# EAGLE design coil (EAGLE 8.0.2)
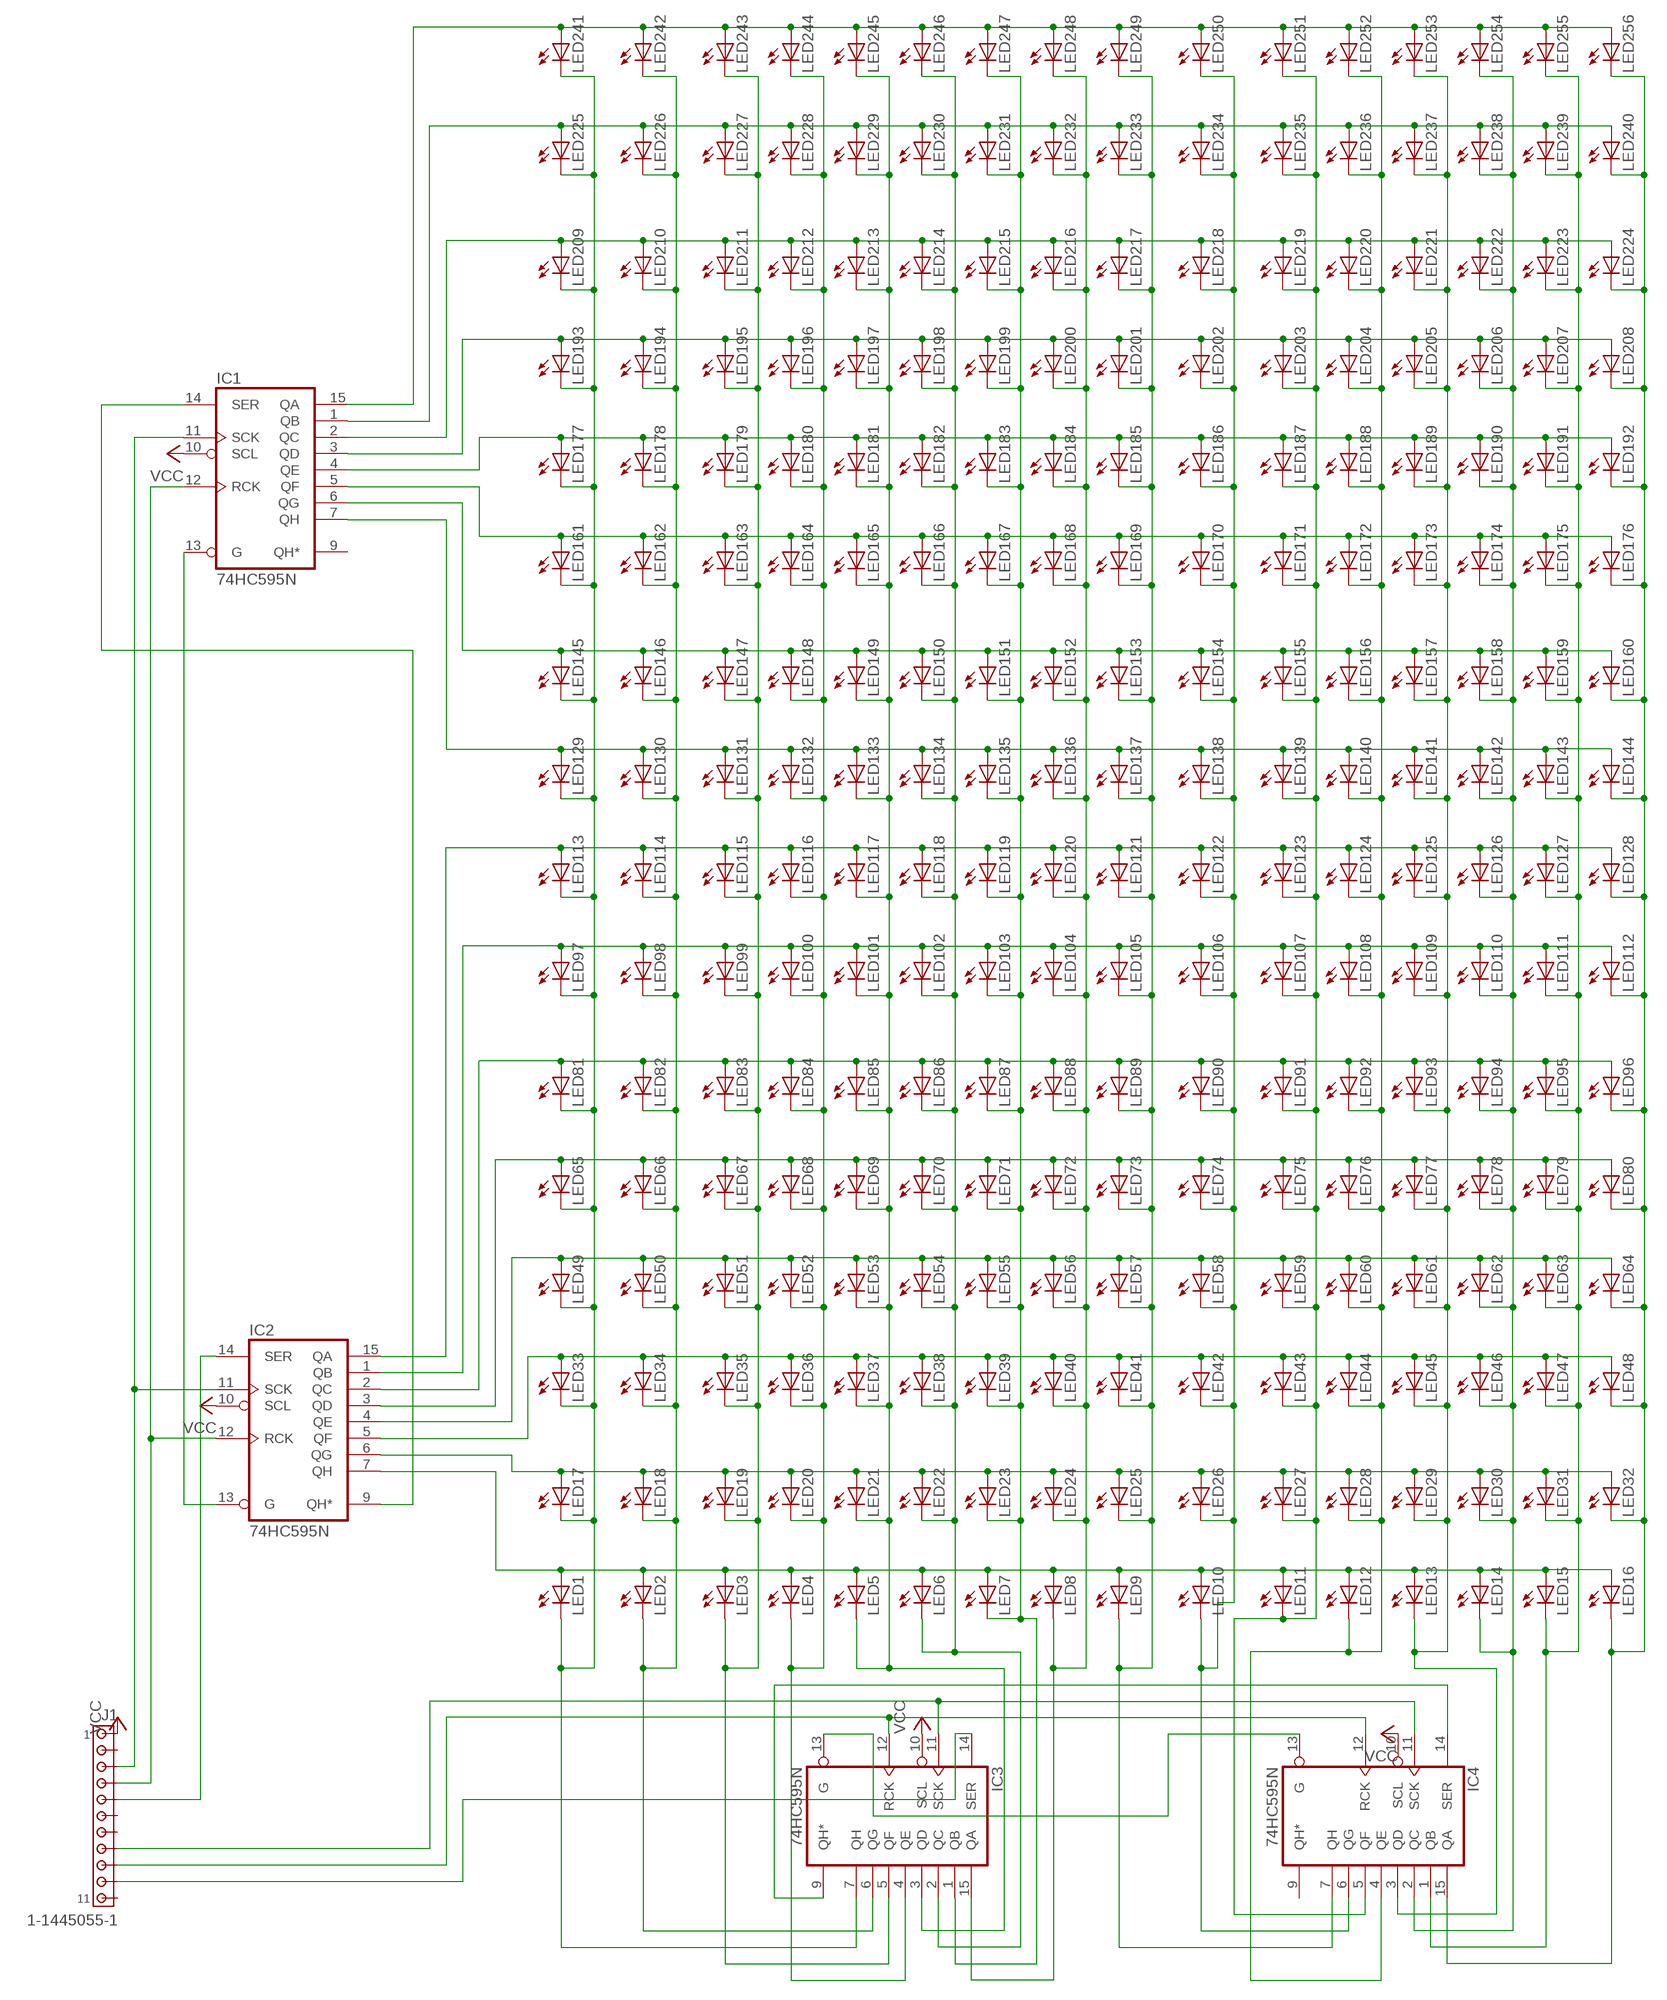
[diagram p0: schematic, sheet 1]

## Parts
IC1  74HC595N  [DIL16]
IC2  74HC595N  [DIL16]
IC3  74HC595N  [DIL16]
IC4  74HC595N  [DIL16]
J1  1-1445055-1  [1-1445055-1]
LED1  LED5MM  [LED5MM]
LED2  LED5MM  [LED5MM]
LED3  LED5MM  [LED5MM]
LED4  LED5MM  [LED5MM]
LED5  LED5MM  [LED5MM]
LED6  LED5MM  [LED5MM]
LED7  LED5MM  [LED5MM]
LED8  LED5MM  [LED5MM]
LED9  LED5MM  [LED5MM]
LED10  LED5MM  [LED5MM]
LED11  LED5MM  [LED5MM]
LED12  LED5MM  [LED5MM]
LED13  LED5MM  [LED5MM]
LED14  LED5MM  [LED5MM]
LED15  LED5MM  [LED5MM]
LED16  LED5MM  [LED5MM]
LED17  LED5MM  [LED5MM]
LED18  LED5MM  [LED5MM]
LED19  LED5MM  [LED5MM]
LED20  LED5MM  [LED5MM]
LED21  LED5MM  [LED5MM]
LED22  LED5MM  [LED5MM]
LED23  LED5MM  [LED5MM]
LED24  LED5MM  [LED5MM]
LED25  LED5MM  [LED5MM]
LED26  LED5MM  [LED5MM]
LED27  LED5MM  [LED5MM]
LED28  LED5MM  [LED5MM]
LED29  LED5MM  [LED5MM]
LED30  LED5MM  [LED5MM]
LED31  LED5MM  [LED5MM]
LED32  LED5MM  [LED5MM]
LED33  LED5MM  [LED5MM]
LED34  LED5MM  [LED5MM]
LED35  LED5MM  [LED5MM]
LED36  LED5MM  [LED5MM]
LED37  LED5MM  [LED5MM]
LED38  LED5MM  [LED5MM]
LED39  LED5MM  [LED5MM]
LED40  LED5MM  [LED5MM]
LED41  LED5MM  [LED5MM]
LED42  LED5MM  [LED5MM]
LED43  LED5MM  [LED5MM]
LED44  LED5MM  [LED5MM]
LED45  LED5MM  [LED5MM]
LED46  LED5MM  [LED5MM]
LED47  LED5MM  [LED5MM]
LED48  LED5MM  [LED5MM]
LED49  LED5MM  [LED5MM]
LED50  LED5MM  [LED5MM]
LED51  LED5MM  [LED5MM]
LED52  LED5MM  [LED5MM]
LED53  LED5MM  [LED5MM]
LED54  LED5MM  [LED5MM]
LED55  LED5MM  [LED5MM]
LED56  LED5MM  [LED5MM]
LED57  LED5MM  [LED5MM]
LED58  LED5MM  [LED5MM]
LED59  LED5MM  [LED5MM]
LED60  LED5MM  [LED5MM]
LED61  LED5MM  [LED5MM]
LED62  LED5MM  [LED5MM]
LED63  LED5MM  [LED5MM]
LED64  LED5MM  [LED5MM]
LED65  LED5MM  [LED5MM]
LED66  LED5MM  [LED5MM]
LED67  LED5MM  [LED5MM]
LED68  LED5MM  [LED5MM]
LED69  LED5MM  [LED5MM]
LED70  LED5MM  [LED5MM]
LED71  LED5MM  [LED5MM]
LED72  LED5MM  [LED5MM]
LED73  LED5MM  [LED5MM]
LED74  LED5MM  [LED5MM]
LED75  LED5MM  [LED5MM]
LED76  LED5MM  [LED5MM]
LED77  LED5MM  [LED5MM]
LED78  LED5MM  [LED5MM]
LED79  LED5MM  [LED5MM]
LED80  LED5MM  [LED5MM]
LED81  LED5MM  [LED5MM]
LED82  LED5MM  [LED5MM]
LED83  LED5MM  [LED5MM]
LED84  LED5MM  [LED5MM]
LED85  LED5MM  [LED5MM]
LED86  LED5MM  [LED5MM]
LED87  LED5MM  [LED5MM]
LED88  LED5MM  [LED5MM]
LED89  LED5MM  [LED5MM]
LED90  LED5MM  [LED5MM]
LED91  LED5MM  [LED5MM]
LED92  LED5MM  [LED5MM]
LED93  LED5MM  [LED5MM]
LED94  LED5MM  [LED5MM]
LED95  LED5MM  [LED5MM]
LED96  LED5MM  [LED5MM]
LED97  LED5MM  [LED5MM]
LED98  LED5MM  [LED5MM]
LED99  LED5MM  [LED5MM]
LED100  LED5MM  [LED5MM]
LED101  LED5MM  [LED5MM]
LED102  LED5MM  [LED5MM]
LED103  LED5MM  [LED5MM]
LED104  LED5MM  [LED5MM]
LED105  LED5MM  [LED5MM]
LED106  LED5MM  [LED5MM]
LED107  LED5MM  [LED5MM]
LED108  LED5MM  [LED5MM]
LED109  LED5MM  [LED5MM]
LED110  LED5MM  [LED5MM]
LED111  LED5MM  [LED5MM]
LED112  LED5MM  [LED5MM]
LED113  LED5MM  [LED5MM]
LED114  LED5MM  [LED5MM]
LED115  LED5MM  [LED5MM]
LED116  LED5MM  [LED5MM]
LED117  LED5MM  [LED5MM]
LED118  LED5MM  [LED5MM]
LED119  LED5MM  [LED5MM]
LED120  LED5MM  [LED5MM]
LED121  LED5MM  [LED5MM]
LED122  LED5MM  [LED5MM]
LED123  LED5MM  [LED5MM]
LED124  LED5MM  [LED5MM]
LED125  LED5MM  [LED5MM]
LED126  LED5MM  [LED5MM]
LED127  LED5MM  [LED5MM]
LED128  LED5MM  [LED5MM]
LED129  LED5MM  [LED5MM]
LED130  LED5MM  [LED5MM]
LED131  LED5MM  [LED5MM]
LED132  LED5MM  [LED5MM]
LED133  LED5MM  [LED5MM]
LED134  LED5MM  [LED5MM]
LED135  LED5MM  [LED5MM]
LED136  LED5MM  [LED5MM]
LED137  LED5MM  [LED5MM]
LED138  LED5MM  [LED5MM]
LED139  LED5MM  [LED5MM]
LED140  LED5MM  [LED5MM]
LED141  LED5MM  [LED5MM]
LED142  LED5MM  [LED5MM]
LED143  LED5MM  [LED5MM]
LED144  LED5MM  [LED5MM]
LED145  LED5MM  [LED5MM]
LED146  LED5MM  [LED5MM]
LED147  LED5MM  [LED5MM]
LED148  LED5MM  [LED5MM]
LED149  LED5MM  [LED5MM]
LED150  LED5MM  [LED5MM]
LED151  LED5MM  [LED5MM]
LED152  LED5MM  [LED5MM]
LED153  LED5MM  [LED5MM]
LED154  LED5MM  [LED5MM]
LED155  LED5MM  [LED5MM]
LED156  LED5MM  [LED5MM]
LED157  LED5MM  [LED5MM]
LED158  LED5MM  [LED5MM]
LED159  LED5MM  [LED5MM]
LED160  LED5MM  [LED5MM]
LED161  LED5MM  [LED5MM]
LED162  LED5MM  [LED5MM]
LED163  LED5MM  [LED5MM]
LED164  LED5MM  [LED5MM]
LED165  LED5MM  [LED5MM]
LED166  LED5MM  [LED5MM]
LED167  LED5MM  [LED5MM]
LED168  LED5MM  [LED5MM]
LED169  LED5MM  [LED5MM]
LED170  LED5MM  [LED5MM]
LED171  LED5MM  [LED5MM]
LED172  LED5MM  [LED5MM]
LED173  LED5MM  [LED5MM]
LED174  LED5MM  [LED5MM]
LED175  LED5MM  [LED5MM]
LED176  LED5MM  [LED5MM]
LED177  LED5MM  [LED5MM]
LED178  LED5MM  [LED5MM]
LED179  LED5MM  [LED5MM]
LED180  LED5MM  [LED5MM]
LED181  LED5MM  [LED5MM]
LED182  LED5MM  [LED5MM]
LED183  LED5MM  [LED5MM]
LED184  LED5MM  [LED5MM]
LED185  LED5MM  [LED5MM]
LED186  LED5MM  [LED5MM]
LED187  LED5MM  [LED5MM]
LED188  LED5MM  [LED5MM]
LED189  LED5MM  [LED5MM]
LED190  LED5MM  [LED5MM]
LED191  LED5MM  [LED5MM]
LED192  LED5MM  [LED5MM]
LED193  LED5MM  [LED5MM]
LED194  LED5MM  [LED5MM]
LED195  LED5MM  [LED5MM]
LED196  LED5MM  [LED5MM]
LED197  LED5MM  [LED5MM]
LED198  LED5MM  [LED5MM]
LED199  LED5MM  [LED5MM]
LED200  LED5MM  [LED5MM]
LED201  LED5MM  [LED5MM]
LED202  LED5MM  [LED5MM]
LED203  LED5MM  [LED5MM]
LED204  LED5MM  [LED5MM]
LED205  LED5MM  [LED5MM]
LED206  LED5MM  [LED5MM]
LED207  LED5MM  [LED5MM]
LED208  LED5MM  [LED5MM]
LED209  LED5MM  [LED5MM]
LED210  LED5MM  [LED5MM]
LED211  LED5MM  [LED5MM]
LED212  LED5MM  [LED5MM]
LED213  LED5MM  [LED5MM]
LED214  LED5MM  [LED5MM]
LED215  LED5MM  [LED5MM]
LED216  LED5MM  [LED5MM]
LED217  LED5MM  [LED5MM]
LED218  LED5MM  [LED5MM]
LED219  LED5MM  [LED5MM]
LED220  LED5MM  [LED5MM]
LED221  LED5MM  [LED5MM]
LED222  LED5MM  [LED5MM]
LED223  LED5MM  [LED5MM]
LED224  LED5MM  [LED5MM]
LED225  LED5MM  [LED5MM]
LED226  LED5MM  [LED5MM]
LED227  LED5MM  [LED5MM]
LED228  LED5MM  [LED5MM]
LED229  LED5MM  [LED5MM]
LED230  LED5MM  [LED5MM]
LED231  LED5MM  [LED5MM]
LED232  LED5MM  [LED5MM]
LED233  LED5MM  [LED5MM]
LED234  LED5MM  [LED5MM]
LED235  LED5MM  [LED5MM]
LED236  LED5MM  [LED5MM]
LED237  LED5MM  [LED5MM]
LED238  LED5MM  [LED5MM]
LED239  LED5MM  [LED5MM]
LED240  LED5MM  [LED5MM]
LED241  LED5MM  [LED5MM]
LED242  LED5MM  [LED5MM]
LED243  LED5MM  [LED5MM]
LED244  LED5MM  [LED5MM]
LED245  LED5MM  [LED5MM]
LED246  LED5MM  [LED5MM]
LED247  LED5MM  [LED5MM]
LED248  LED5MM  [LED5MM]
LED249  LED5MM  [LED5MM]
LED250  LED5MM  [LED5MM]
LED251  LED5MM  [LED5MM]
LED252  LED5MM  [LED5MM]
LED253  LED5MM  [LED5MM]
LED254  LED5MM  [LED5MM]
LED255  LED5MM  [LED5MM]
LED256  LED5MM  [LED5MM]

## Nets
N$1: IC2.7(QH) LED1.A LED2.A LED3.A LED4.A LED5.A LED6.A LED7.A LED8.A LED9.A LED10.A LED11.A LED12.A LED13.A LED14.A LED15.A LED16.A
N$2: IC2.6(QG) LED17.A LED18.A LED19.A LED20.A LED21.A LED22.A LED23.A LED24.A LED25.A LED26.A LED27.A LED28.A LED29.A LED30.A LED31.A LED32.A
N$3: IC2.5(QF) LED33.A LED34.A LED35.A LED36.A LED37.A LED38.A LED39.A LED40.A LED41.A LED42.A LED43.A LED44.A LED45.A LED46.A LED47.A LED48.A
N$4: IC2.4(QE) LED49.A LED50.A LED51.A LED52.A LED53.A LED54.A LED55.A LED56.A LED57.A LED58.A LED59.A LED60.A LED61.A LED62.A LED63.A LED64.A
N$5: IC2.3(QD) LED65.A LED66.A LED67.A LED68.A LED69.A LED70.A LED71.A LED72.A LED73.A LED74.A LED75.A LED76.A LED77.A LED78.A LED79.A LED80.A
N$6: IC2.2(QC) LED81.A LED82.A LED83.A LED84.A LED85.A LED86.A LED87.A LED88.A LED89.A LED90.A LED91.A LED92.A LED93.A LED94.A LED95.A LED96.A
N$7: IC2.1(QB) LED97.A LED98.A LED99.A LED100.A LED101.A LED102.A LED103.A LED104.A LED105.A LED106.A LED107.A LED108.A LED109.A LED110.A LED111.A LED112.A
N$8: IC2.15(QA) LED113.A LED114.A LED115.A LED116.A LED117.A LED118.A LED119.A LED120.A LED121.A LED122.A LED123.A LED124.A LED125.A LED126.A LED127.A LED128.A
N$9: IC1.7(QH) LED129.A LED130.A LED131.A LED132.A LED133.A LED134.A LED135.A LED136.A LED137.A LED138.A LED139.A LED140.A LED141.A LED142.A LED143.A LED144.A
N$10: IC1.6(QG) LED145.A LED146.A LED147.A LED148.A LED149.A LED150.A LED151.A LED152.A LED153.A LED154.A LED155.A LED156.A LED157.A LED158.A LED159.A LED160.A
N$11: IC1.5(QF) LED161.A LED162.A LED163.A LED164.A LED165.A LED166.A LED167.A LED168.A LED169.A LED170.A LED171.A LED172.A LED173.A LED174.A LED175.A LED176.A
N$12: IC1.4(QE) LED177.A LED178.A LED179.A LED180.A LED181.A LED182.A LED183.A LED184.A LED185.A LED186.A LED187.A LED188.A LED189.A LED190.A LED191.A LED192.A
N$13: IC1.3(QD) LED193.A LED194.A LED195.A LED196.A LED197.A LED198.A LED199.A LED200.A LED201.A LED202.A LED203.A LED204.A LED205.A LED206.A LED207.A LED208.A
N$14: IC1.2(QC) LED209.A LED210.A LED211.A LED212.A LED213.A LED214.A LED215.A LED216.A LED217.A LED218.A LED219.A LED220.A LED221.A LED222.A LED223.A LED224.A
N$15: IC1.1(QB) LED225.A LED226.A LED227.A LED228.A LED229.A LED230.A LED231.A LED232.A LED233.A LED234.A LED235.A LED236.A LED237.A LED238.A LED239.A LED240.A
N$16: IC1.15(QA) LED241.A LED242.A LED243.A LED244.A LED245.A LED246.A LED247.A LED248.A LED249.A LED250.A LED251.A LED252.A LED253.A LED254.A LED255.A LED256.A
N$17: IC4.3(QD) LED13.K(C) LED29.K(C) LED45.K(C) LED61.K(C) LED77.K(C) LED93.K(C) LED109.K(C) LED125.K(C) LED141.K(C) LED157.K(C) LED173.K(C) LED189.K(C) LED205.K(C) LED221.K(C) LED237.K(C) LED253.K(C)
N$18: IC4.2(QC) LED14.K(C) LED30.K(C) LED46.K(C) LED62.K(C) LED78.K(C) LED94.K(C) LED110.K(C) LED126.K(C) LED142.K(C) LED158.K(C) LED174.K(C) LED190.K(C) LED206.K(C) LED222.K(C) LED238.K(C) LED254.K(C)
N$19: IC4.1(QB) LED15.K(C) LED31.K(C) LED47.K(C) LED63.K(C) LED79.K(C) LED95.K(C) LED111.K(C) LED127.K(C) LED143.K(C) LED159.K(C) LED175.K(C) LED191.K(C) LED207.K(C) LED223.K(C) LED239.K(C) LED255.K(C)
N$20: IC3.7(QH) LED1.K(C) LED17.K(C) LED33.K(C) LED49.K(C) LED65.K(C) LED81.K(C) LED97.K(C) LED113.K(C) LED129.K(C) LED145.K(C) LED161.K(C) LED177.K(C) LED193.K(C) LED209.K(C) LED225.K(C) LED241.K(C)
N$21: IC3.6(QG) LED2.K(C) LED18.K(C) LED34.K(C) LED50.K(C) LED66.K(C) LED82.K(C) LED98.K(C) LED114.K(C) LED130.K(C) LED146.K(C) LED162.K(C) LED178.K(C) LED194.K(C) LED210.K(C) LED226.K(C) LED242.K(C)
N$22: IC3.5(QF) LED3.K(C) LED19.K(C) LED35.K(C) LED51.K(C) LED67.K(C) LED83.K(C) LED99.K(C) LED115.K(C) LED131.K(C) LED147.K(C) LED163.K(C) LED179.K(C) LED195.K(C) LED211.K(C) LED227.K(C) LED243.K(C)
N$23: IC3.4(QE) LED4.K(C) LED20.K(C) LED36.K(C) LED52.K(C) LED68.K(C) LED84.K(C) LED100.K(C) LED116.K(C) LED132.K(C) LED148.K(C) LED164.K(C) LED180.K(C) LED196.K(C) LED212.K(C) LED228.K(C) LED244.K(C)
N$24: IC3.3(QD) LED5.K(C) LED21.K(C) LED37.K(C) LED53.K(C) LED69.K(C) LED85.K(C) LED101.K(C) LED117.K(C) LED133.K(C) LED149.K(C) LED165.K(C) LED181.K(C) LED197.K(C) LED213.K(C) LED229.K(C) LED245.K(C)
N$25: IC3.2(QC) LED6.K(C) LED22.K(C) LED38.K(C) LED54.K(C) LED70.K(C) LED86.K(C) LED102.K(C) LED118.K(C) LED134.K(C) LED150.K(C) LED166.K(C) LED182.K(C) LED198.K(C) LED214.K(C) LED230.K(C) LED246.K(C)
N$26: IC3.1(QB) LED7.K(C) LED23.K(C) LED39.K(C) LED55.K(C) LED71.K(C) LED87.K(C) LED103.K(C) LED119.K(C) LED135.K(C) LED151.K(C) LED167.K(C) LED183.K(C) LED199.K(C) LED215.K(C) LED231.K(C) LED247.K(C)
N$27: IC3.15(QA) LED8.K(C) LED24.K(C) LED40.K(C) LED56.K(C) LED72.K(C) LED88.K(C) LED104.K(C) LED120.K(C) LED136.K(C) LED152.K(C) LED168.K(C) LED184.K(C) LED200.K(C) LED216.K(C) LED232.K(C) LED248.K(C)
N$28: IC4.7(QH) LED9.K(C) LED25.K(C) LED41.K(C) LED57.K(C) LED73.K(C) LED89.K(C) LED105.K(C) LED121.K(C) LED137.K(C) LED153.K(C) LED169.K(C) LED185.K(C) LED201.K(C) LED217.K(C) LED233.K(C) LED249.K(C)
N$29: IC4.6(QG) LED10.K(C) LED26.K(C) LED42.K(C) LED58.K(C) LED74.K(C) LED90.K(C) LED106.K(C) LED122.K(C) LED138.K(C) LED154.K(C) LED170.K(C) LED186.K(C) LED202.K(C) LED218.K(C) LED234.K(C) LED250.K(C)
N$30: IC4.5(QF) LED11.K(C) LED27.K(C) LED43.K(C) LED59.K(C) LED75.K(C) LED91.K(C) LED107.K(C) LED123.K(C) LED139.K(C) LED155.K(C) LED171.K(C) LED187.K(C) LED203.K(C) LED219.K(C) LED235.K(C) LED251.K(C)
N$31: IC4.4(QE) LED12.K(C) LED28.K(C) LED44.K(C) LED60.K(C) LED76.K(C) LED92.K(C) LED108.K(C) LED124.K(C) LED140.K(C) LED156.K(C) LED172.K(C) LED188.K(C) LED204.K(C) LED220.K(C) LED236.K(C) LED252.K(C)
N$32: IC4.15(QA) LED16.K(C) LED32.K(C) LED48.K(C) LED64.K(C) LED80.K(C) LED96.K(C) LED112.K(C) LED128.K(C) LED144.K(C) LED160.K(C) LED176.K(C) LED192.K(C) LED208.K(C) LED224.K(C) LED240.K(C) LED256.K(C)
N$51: IC3.11(SCK) IC4.11(SCK) J1.8
N$53: IC3.12(RCK) IC4.12(RCK) J1.9
N$54: IC3.9(QH*) IC4.14(SER)
N$56: IC3.13(G) IC4.13(G)
N$58: IC1.14(SER) IC2.9(QH*)
N$59: IC1.11(SCK) IC2.11(SCK) J1.3
N$60: IC1.12(RCK) IC2.12(RCK) J1.4
N$61: IC1.13(G) IC2.13(G)
N$62: IC2.14(SER) J1.5
N$64: IC3.14(SER) J1.10
VCC: IC1.10(SCL) IC2.10(SCL) IC3.10(SCL) IC4.10(SCL) J1.1
Unconnected: IC1.9(QH*) IC4.9(QH*) J1.2 J1.6 J1.7 J1.11

## Power pins joined to a net without a drawn wire
GND: IC1.8(GND) IC2.8(GND) IC3.8(GND) IC4.8(GND)
VCC: IC1.16(VCC) IC2.16(VCC) IC3.16(VCC) IC4.16(VCC)

## Library data of the parts
IC1-IC4 = 74xx-eu:74*595: 8-bit SHIFT REGISTER, output latch
J1 = con-amp:1-1445055-1: Micro MATE-N-LOK Connectors grid 1.5 mm Source: ENG_CD_1445055_A.pdf
LED1-LED256 = led:LED: LED OSRAM: - CHIPLED LG R971, LG N971, LY N971, LG Q971, LY Q971, LO R971, LY R971 LH N974, LH R974 LS Q976, LO Q976, LY Q976 LO Q996 - Hyper CHIPLED LW Q18S LB Q993, LB Q99A, LB R99A - SideLED LS A670, LO A670, LY A670, LG A670, LP A670 LB A673, LV A673, LT A673, LW A673 LH A674 LY A675 LS A676, LA A676, LO A676, LY A676, LW A676 LS A679, LY A679, LG A679 - Hyper Micro SIDELED® LS Y876, LA Y876, LO Y876, LY Y876 LT Y87S - SmartLED LW L88C, LW L88S LB L89C, LB L89S, LG L890 LS L89K, LO L89K, LY L89K LS L896, LA L896, LO L896, LY L896 - TOPLED LS T670, LO T670, LY T670, LG T670, LP T670 LSG T670, LSP T670, LSY T670, LOP T670, LYG T670 LG T671, LOG T671, LSG T671 LB T673, LV T673, LT T673, LW T673 LH T674 LS T676, LA T676, LO T676, LY T676, LB T676, LH T676, LSB T676, LW T676 LB T67C, LV T67C, LT T67C, LS T67K, LO T67K, LY T67K, LW E67C LS E67B, LA E67B, LO E67B, LY E67B, LB E67C, LV E67C, LT E67C LW T67C LS T679, LY T679, LG T679 LS T770, LO T770, LY T770, LG T770, LP T770 LB T773, LV T773, LT T773, LW T773 LH T774 LS E675, LA E675, LY E675, LS T675 LS T776, LA T776, LO T776, LY T776, LB T776 LHGB T686 LT T68C, LB T68C - Hyper Mini TOPLED® LB M676 - Mini TOPLED Santana® LG M470 LS M47K, LO M47K, LY M47K Source: http://www.osram.convergy.de LUXEON: - LUMILED® LXK2-PW12-R00, LXK2-PW12-S00, LXK2-PW14-U00, LXK2-PW14-V00 LXK2-PM12-R00, LXK2-PM12-S00, LXK2-PM14-U00 LXK2-PE12-Q00, LXK2-PE12-R00, LXK2-PE12-S00, LXK2-PE14-T00, LXK2-PE14-U00 LXK2-PB12-K00, LXK2-PB12-L00, LXK2-PB12-M00, LXK2-PB14-N00, LXK2-PB14-P00, LXK2-PB14-Q00 LXK2-PR12-L00, LXK2-PR12-M00, LXK2-PR14-Q00, LXK2-PR14-R00 LXK2-PD12-Q00, LXK2-PD12-R00, LXK2-PD12-S00 LXK2-PH12-R00, LXK2-PH12-S00 LXK2-PL12-P00, LXK2-PL12-Q00, LXK2-PL12-R00 Source: www.luxeon.com KINGBRIGHT: KA-3528ASYC Source: www.kingbright.com

## Board
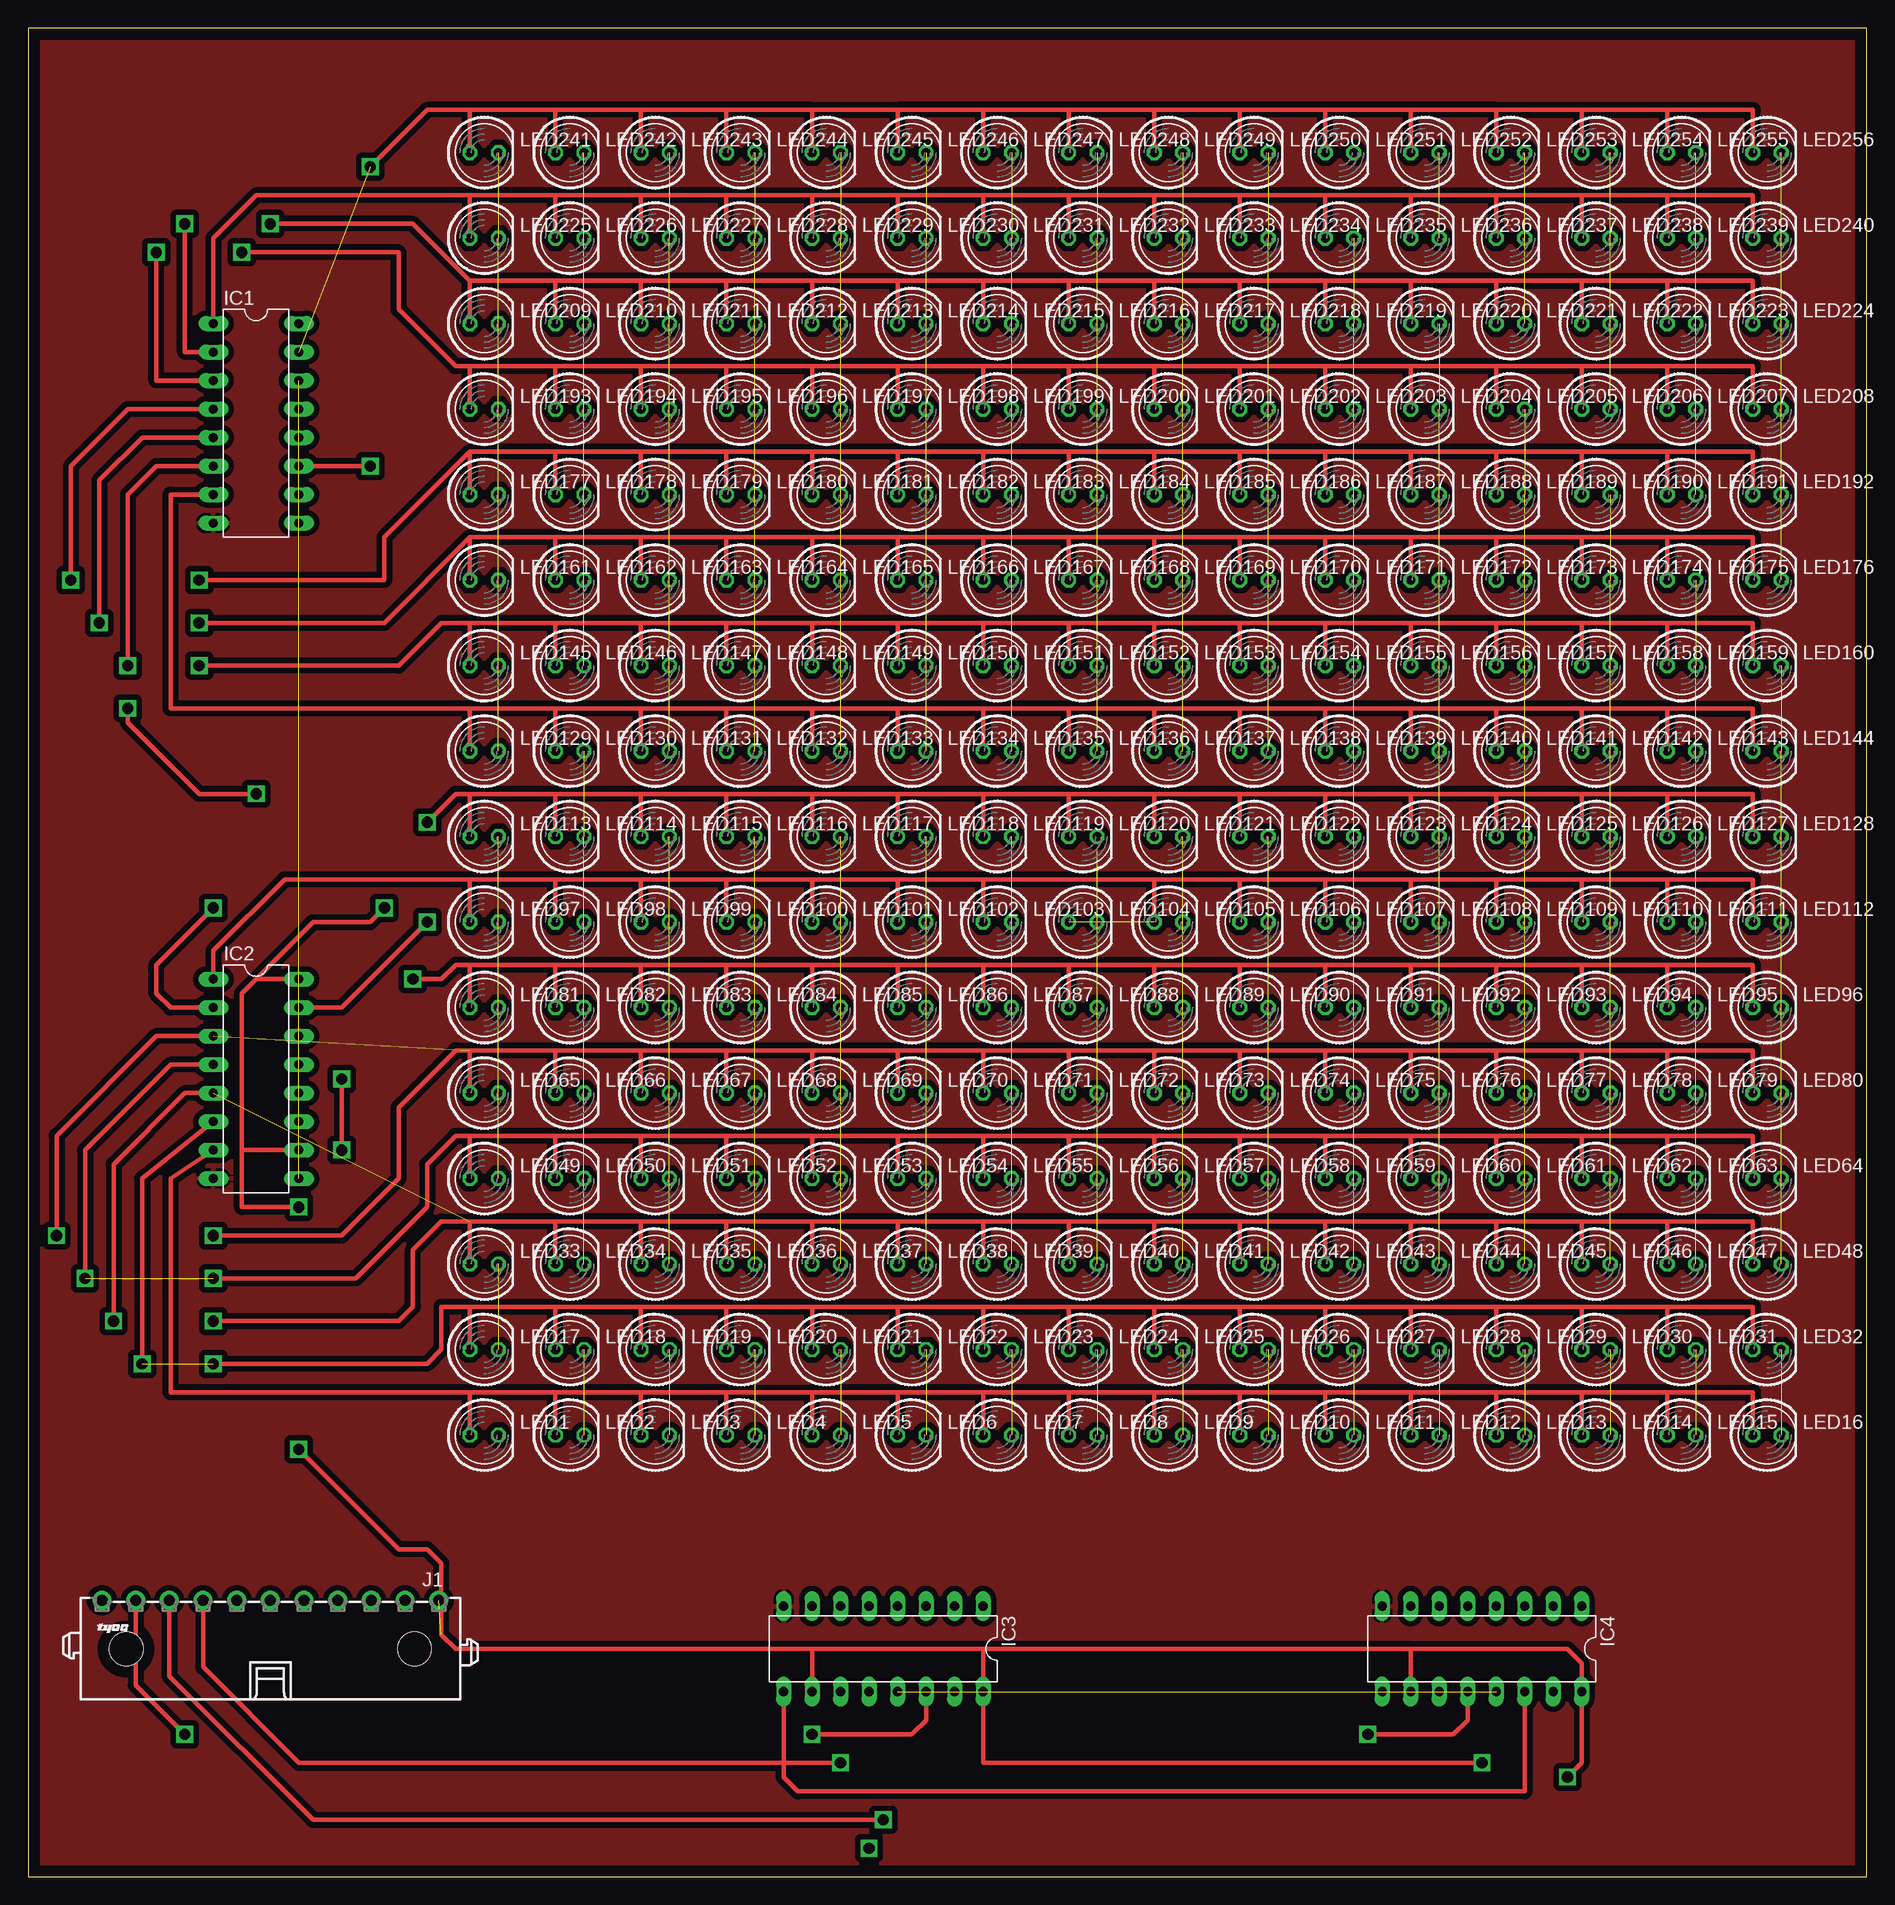
[diagram p1: board, top side]
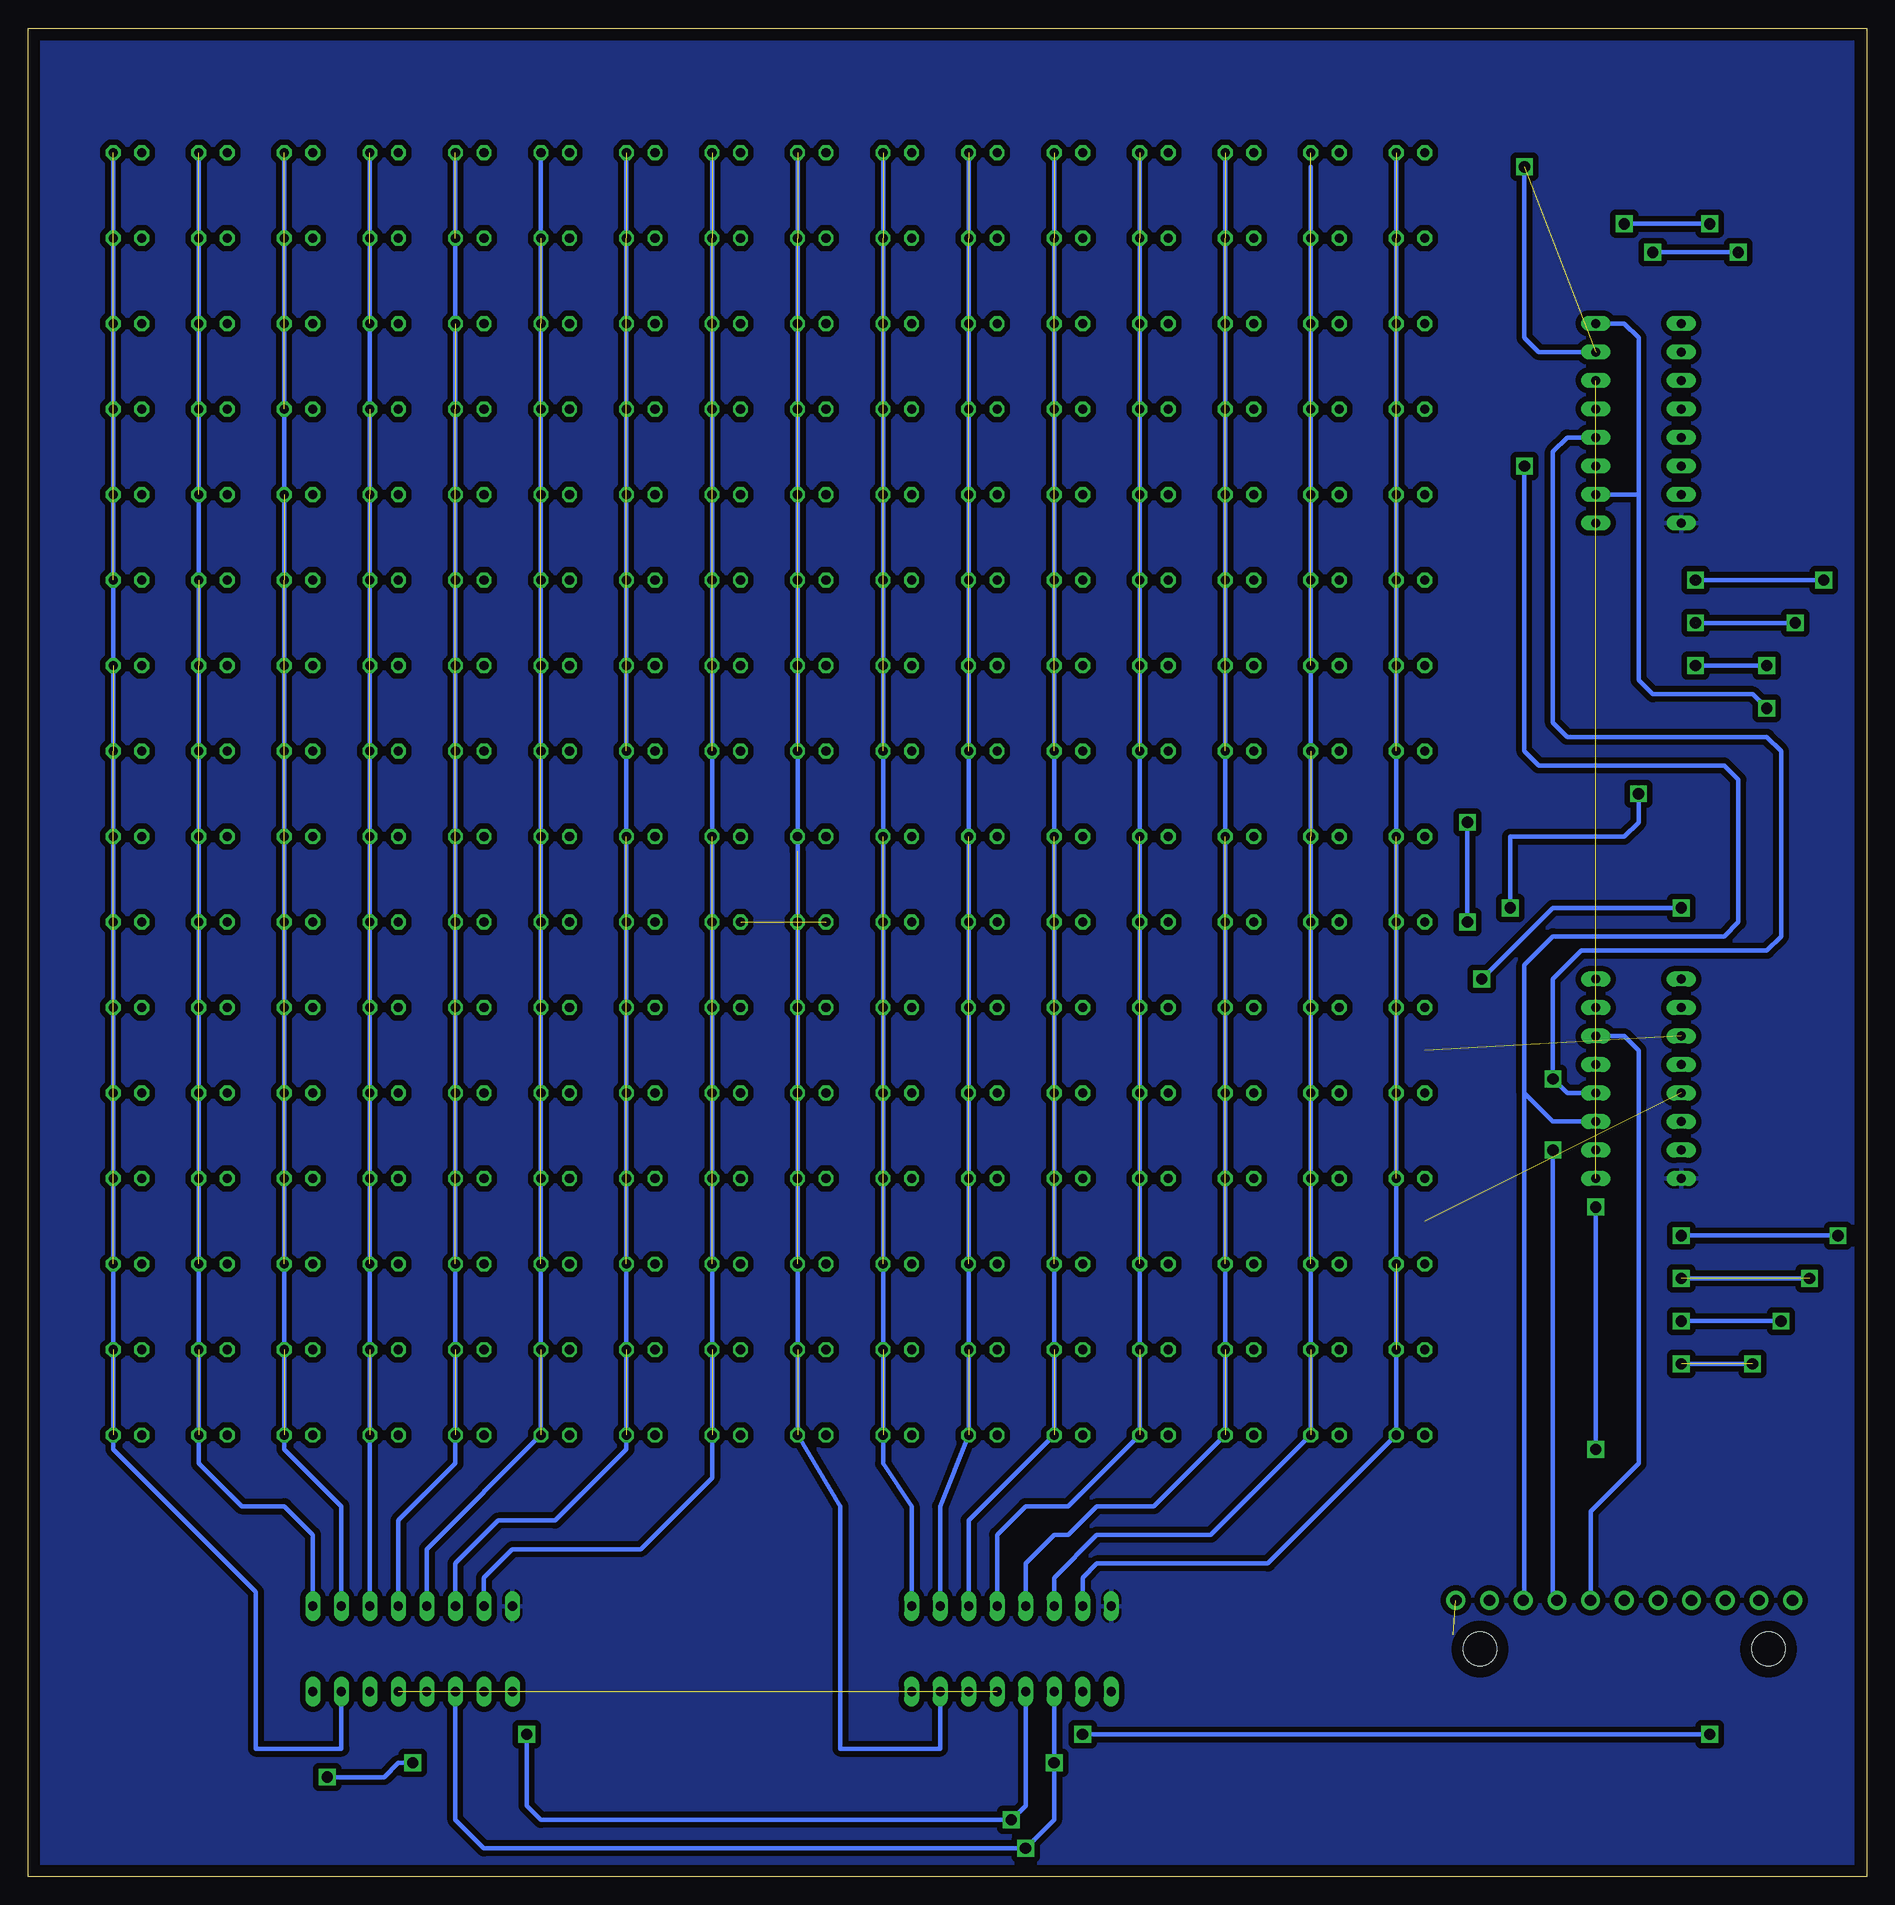
[diagram p2: board, bottom side, seen from below]

Size 163.81 x 164.77 mm. Coordinates in mm from the lower left corner, seen from the top.
Outline: 0,0 163.81,0 163.81,164.77 0,164.77 0,0
Copper layers (1*16): Top 0.035mm / dielectric 1.5mm / Bottom 0.035mm
Design rules "default": minimum track width 10mil, minimum drill 24mil, track to track 8mil, track to pad 8mil, pad to pad 8mil, via to via 8mil, smd to smd 8mil, copper to edge 40mil, drill to drill 8mil, minimum pad ring 10mil, minimum via ring 8mil, stop-mask expansion 4mil, vias tented up to drill 0mil, thermal gap 10mil

### Footprints (pad centres in the part's own frame; a part is rotated, then mirrored left to right if it is on the bottom)
DIL16 = drill 0.813 long: 1 -8.89,-3.81; 2 -6.35,-3.81; 3 -3.81,-3.81; 4 -1.27,-3.81; 5 1.27,-3.81; 6 3.81,-3.81; 7 6.35,-3.81; 8 8.89,-3.81; 9 8.89,3.81; 10 6.35,3.81; 11 3.81,3.81; 12 1.27,3.81; 13 -1.27,3.81; 14 -3.81,3.81; 15 -6.35,3.81; 16 -8.89,3.81
1-1445055-1 = drill 1 pad 1.676: 1 15,4.32; 2 12,4.32; 3 9,4.32; 4 6,4.32; 5 3,4.32; 6 0,4.32; 7 -3,4.32; 8 -6,4.32; 9 -9,4.32; 10 -12,4.32; 11 -15,4.32 | hole 3: -12.85,0; 12.85,0
LED5MM = drill 0.813 octagon: A -1.27,0; K 1.27,0

### Placement (x,y rotation side)
IC1  20.32,129.54 270 top
IC2  20.32,71.12 270 top
IC3  76.2,20.32 180 top
IC4  129.54,20.32 180 top
J1  21.59,20.32 0 top
LED1  40.64,39.37 0 top
LED2  48.26,39.37 0 top
LED3  55.88,39.37 0 top
LED4  63.5,39.37 0 top
LED5  71.12,39.37 0 top
LED6  78.74,39.37 0 top
LED7  86.36,39.37 0 top
LED8  93.98,39.37 0 top
LED9  101.6,39.37 0 top
LED10  109.22,39.37 0 top
LED11  116.84,39.37 0 top
LED12  124.46,39.37 0 top
LED13  132.08,39.37 0 top
LED14  139.7,39.37 0 top
LED15  147.32,39.37 0 top
LED16  154.94,39.37 0 top
LED17  40.64,46.99 0 top
LED18  48.26,46.99 0 top
LED19  55.88,46.99 0 top
LED20  63.5,46.99 0 top
LED21  71.12,46.99 0 top
LED22  78.74,46.99 0 top
LED23  86.36,46.99 0 top
LED24  93.98,46.99 0 top
LED25  101.6,46.99 0 top
LED26  109.22,46.99 0 top
LED27  116.84,46.99 0 top
LED28  124.46,46.99 0 top
LED29  132.08,46.99 0 top
LED30  139.7,46.99 0 top
LED31  147.32,46.99 0 top
LED32  154.94,46.99 0 top
LED33  40.64,54.61 0 top
LED34  48.26,54.61 0 top
LED35  55.88,54.61 0 top
LED36  63.5,54.61 0 top
LED37  71.12,54.61 0 top
LED38  78.74,54.61 0 top
LED39  86.36,54.61 0 top
LED40  93.98,54.61 0 top
LED41  101.6,54.61 0 top
LED42  109.22,54.61 0 top
LED43  116.84,54.61 0 top
LED44  124.46,54.61 0 top
LED45  132.08,54.61 0 top
LED46  139.7,54.61 0 top
LED47  147.32,54.61 0 top
LED48  154.94,54.61 0 top
LED49  40.64,62.23 0 top
LED50  48.26,62.23 0 top
LED51  55.88,62.23 0 top
LED52  63.5,62.23 0 top
LED53  71.12,62.23 0 top
LED54  78.74,62.23 0 top
LED55  86.36,62.23 0 top
LED56  93.98,62.23 0 top
LED57  101.6,62.23 0 top
LED58  109.22,62.23 0 top
LED59  116.84,62.23 0 top
LED60  124.46,62.23 0 top
LED61  132.08,62.23 0 top
LED62  139.7,62.23 0 top
LED63  147.32,62.23 0 top
LED64  154.94,62.23 0 top
LED65  40.64,69.85 0 top
LED66  48.26,69.85 0 top
LED67  55.88,69.85 0 top
LED68  63.5,69.85 0 top
LED69  71.12,69.85 0 top
LED70  78.74,69.85 0 top
LED71  86.36,69.85 0 top
LED72  93.98,69.85 0 top
LED73  101.6,69.85 0 top
LED74  109.22,69.85 0 top
LED75  116.84,69.85 0 top
LED76  124.46,69.85 0 top
LED77  132.08,69.85 0 top
LED78  139.7,69.85 0 top
LED79  147.32,69.85 0 top
LED80  154.94,69.85 0 top
LED81  40.64,77.47 0 top
LED82  48.26,77.47 0 top
LED83  55.88,77.47 0 top
LED84  63.5,77.47 0 top
LED85  71.12,77.47 0 top
LED86  78.74,77.47 0 top
LED87  86.36,77.47 0 top
LED88  93.98,77.47 0 top
LED89  101.6,77.47 0 top
LED90  109.22,77.47 0 top
LED91  116.84,77.47 0 top
LED92  124.46,77.47 0 top
LED93  132.08,77.47 0 top
LED94  139.7,77.47 0 top
LED95  147.32,77.47 0 top
LED96  154.94,77.47 0 top
LED97  40.64,85.09 0 top
LED98  48.26,85.09 0 top
LED99  55.88,85.09 0 top
LED100  63.5,85.09 0 top
LED101  71.12,85.09 0 top
LED102  78.74,85.09 0 top
LED103  86.36,85.09 0 top
LED104  93.98,85.09 0 top
LED105  101.6,85.09 0 top
LED106  109.22,85.09 0 top
LED107  116.84,85.09 0 top
LED108  124.46,85.09 0 top
LED109  132.08,85.09 0 top
LED110  139.7,85.09 0 top
LED111  147.32,85.09 0 top
LED112  154.94,85.09 0 top
LED113  40.64,92.71 0 top
LED114  48.26,92.71 0 top
LED115  55.88,92.71 0 top
LED116  63.5,92.71 0 top
LED117  71.12,92.71 0 top
LED118  78.74,92.71 0 top
LED119  86.36,92.71 0 top
LED120  93.98,92.71 0 top
LED121  101.6,92.71 0 top
LED122  109.22,92.71 0 top
LED123  116.84,92.71 0 top
LED124  124.46,92.71 0 top
LED125  132.08,92.71 0 top
LED126  139.7,92.71 0 top
LED127  147.32,92.71 0 top
LED128  154.94,92.71 0 top
LED129  40.64,100.33 0 top
LED130  48.26,100.33 0 top
LED131  55.88,100.33 0 top
LED132  63.5,100.33 0 top
LED133  71.12,100.33 0 top
LED134  78.74,100.33 0 top
LED135  86.36,100.33 0 top
LED136  93.98,100.33 0 top
LED137  101.6,100.33 0 top
LED138  109.22,100.33 0 top
LED139  116.84,100.33 0 top
LED140  124.46,100.33 0 top
LED141  132.08,100.33 0 top
LED142  139.7,100.33 0 top
LED143  147.32,100.33 0 top
LED144  154.94,100.33 0 top
LED145  40.64,107.95 0 top
LED146  48.26,107.95 0 top
LED147  55.88,107.95 0 top
LED148  63.5,107.95 0 top
LED149  71.12,107.95 0 top
LED150  78.74,107.95 0 top
LED151  86.36,107.95 0 top
LED152  93.98,107.95 0 top
LED153  101.6,107.95 0 top
LED154  109.22,107.95 0 top
LED155  116.84,107.95 0 top
LED156  124.46,107.95 0 top
LED157  132.08,107.95 0 top
LED158  139.7,107.95 0 top
LED159  147.32,107.95 0 top
LED160  154.94,107.95 0 top
LED161  40.64,115.57 0 top
LED162  48.26,115.57 0 top
LED163  55.88,115.57 0 top
LED164  63.5,115.57 0 top
LED165  71.12,115.57 0 top
LED166  78.74,115.57 0 top
LED167  86.36,115.57 0 top
LED168  93.98,115.57 0 top
LED169  101.6,115.57 0 top
LED170  109.22,115.57 0 top
LED171  116.84,115.57 0 top
LED172  124.46,115.57 0 top
LED173  132.08,115.57 0 top
LED174  139.7,115.57 0 top
LED175  147.32,115.57 0 top
LED176  154.94,115.57 0 top
LED177  40.64,123.19 0 top
LED178  48.26,123.19 0 top
LED179  55.88,123.19 0 top
LED180  63.5,123.19 0 top
LED181  71.12,123.19 0 top
LED182  78.74,123.19 0 top
LED183  86.36,123.19 0 top
LED184  93.98,123.19 0 top
LED185  101.6,123.19 0 top
LED186  109.22,123.19 0 top
LED187  116.84,123.19 0 top
LED188  124.46,123.19 0 top
LED189  132.08,123.19 0 top
LED190  139.7,123.19 0 top
LED191  147.32,123.19 0 top
LED192  154.94,123.19 0 top
LED193  40.64,130.81 0 top
LED194  48.26,130.81 0 top
LED195  55.88,130.81 0 top
LED196  63.5,130.81 0 top
LED197  71.12,130.81 0 top
LED198  78.74,130.81 0 top
LED199  86.36,130.81 0 top
LED200  93.98,130.81 0 top
LED201  101.6,130.81 0 top
LED202  109.22,130.81 0 top
LED203  116.84,130.81 0 top
LED204  124.46,130.81 0 top
LED205  132.08,130.81 0 top
LED206  139.7,130.81 0 top
LED207  147.32,130.81 0 top
LED208  154.94,130.81 0 top
LED209  40.64,138.43 0 top
LED210  48.26,138.43 0 top
LED211  55.88,138.43 0 top
LED212  63.5,138.43 0 top
LED213  71.12,138.43 0 top
LED214  78.74,138.43 0 top
LED215  86.36,138.43 0 top
LED216  93.98,138.43 0 top
LED217  101.6,138.43 0 top
LED218  109.22,138.43 0 top
LED219  116.84,138.43 0 top
LED220  124.46,138.43 0 top
LED221  132.08,138.43 0 top
LED222  139.7,138.43 0 top
LED223  147.32,138.43 0 top
LED224  154.94,138.43 0 top
LED225  40.64,146.05 0 top
LED226  48.26,146.05 0 top
LED227  55.88,146.05 0 top
LED228  63.5,146.05 0 top
LED229  71.12,146.05 0 top
LED230  78.74,146.05 0 top
LED231  86.36,146.05 0 top
LED232  93.98,146.05 0 top
LED233  101.6,146.05 0 top
LED234  109.22,146.05 0 top
LED235  116.84,146.05 0 top
LED236  124.46,146.05 0 top
LED237  132.08,146.05 0 top
LED238  139.7,146.05 0 top
LED239  147.32,146.05 0 top
LED240  154.94,146.05 0 top
LED241  40.64,153.67 0 top
LED242  48.26,153.67 0 top
LED243  55.88,153.67 0 top
LED244  63.5,153.67 0 top
LED245  71.12,153.67 0 top
LED246  78.74,153.67 0 top
LED247  86.36,153.67 0 top
LED248  93.98,153.67 0 top
LED249  101.6,153.67 0 top
LED250  109.22,153.67 0 top
LED251  116.84,153.67 0 top
LED252  124.46,153.67 0 top
LED253  132.08,153.67 0 top
LED254  139.7,153.67 0 top
LED255  147.32,153.67 0 top
LED256  154.94,153.67 0 top

### Tracks (layer width: path | path; a pad name or v marks a point on that pad's centre or on a via)
GND
  pour Top (isolate 0.508): 0,163.83 163.83,163.83 163.83,0 0,0
  pour Bottom (isolate 0.508): 1.27,163.83 162.56,163.83 162.56,6.35 162.56,0 1.27,0
N$1
  Top 0.406: LED1.A 39.37,43.18 | 46.99,43.18 39.37,43.18 | 54.61,43.18 46.99,43.18 | 62.23,43.18 69.85,43.18 | 62.23,43.18 54.61,43.18 | 77.47,43.18 69.85,43.18 | 85.09,43.18 77.47,43.18 | 92.71,43.18 85.09,43.18 | 100.33,43.18 92.71,43.18 | 107.95,43.18 100.33,43.18 | 115.57,43.18 107.95,43.18 | 123.19,43.18 115.57,43.18 | 130.81,43.18 123.19,43.18 | 138.43,43.18 130.81,43.18 | 146.05,43.18 138.43,43.18 | 146.05,43.18 153.67,43.18 LED16.A | LED2.A 46.99,43.18 | LED3.A 54.61,43.18 | LED5.A 69.85,43.18 | LED6.A 77.47,43.18 | LED7.A 85.09,43.18 | LED8.A 92.71,43.18 | LED9.A 100.33,43.18 | LED10.A 107.95,43.18 | LED11.A 115.57,43.18 | LED12.A 123.19,43.18 | LED13.A 130.81,43.18 | LED14.A 138.43,43.18 | LED15.A 146.05,43.18 | LED4.A 62.23,43.18 | 39.37,43.18 12.7,43.18 12.7,62.23 IC2.7
N$2  (1 unrouted)
  Top 0.406: LED17.A 39.37,50.8 | 46.99,50.8 39.37,50.8 | 54.61,50.8 62.23,50.8 | 54.61,50.8 46.99,50.8 | 69.85,50.8 62.23,50.8 | 77.47,50.8 85.09,50.8 | 77.47,50.8 69.85,50.8 | 92.71,50.8 85.09,50.8 | 130.81,50.8 138.43,50.8 | 123.19,50.8 130.81,50.8 | 115.57,50.8 123.19,50.8 | 107.95,50.8 115.57,50.8 | 100.33,50.8 107.95,50.8 | 100.33,50.8 92.71,50.8 | 146.05,50.8 138.43,50.8 | 146.05,50.8 153.67,50.8 LED32.A | LED18.A 46.99,50.8 | LED20.A 62.23,50.8 | LED21.A 69.85,50.8 | LED19.A 54.61,50.8 | LED23.A 85.09,50.8 | LED24.A 92.71,50.8 | LED30.A 138.43,50.8 | LED31.A 146.05,50.8 | LED29.A 130.81,50.8 | LED28.A 123.19,50.8 | LED27.A 115.57,50.8 | LED26.A 107.95,50.8 | LED25.A 100.33,50.8 | LED22.A 77.47,50.8 | IC2.6 10.16,62.23 10.16,45.72 | 39.37,50.8 36.83,50.8 36.83,46.99 35.56,45.72 16.51,45.72
N$3  (1 unrouted)
  Top 0.406: LED33.A 39.37,58.42 46.99,58.42 | 54.61,58.42 62.23,58.42 | 54.61,58.42 46.99,58.42 | 69.85,58.42 62.23,58.42 | 77.47,58.42 69.85,58.42 | 85.09,58.42 77.47,58.42 | 92.71,58.42 85.09,58.42 | 100.33,58.42 92.71,58.42 | 107.95,58.42 100.33,58.42 | 115.57,58.42 107.95,58.42 | 123.19,58.42 115.57,58.42 | 130.81,58.42 123.19,58.42 | 138.43,58.42 130.81,58.42 | 146.05,58.42 138.43,58.42 | 146.05,58.42 153.67,58.42 LED48.A | LED34.A 46.99,58.42 | LED36.A 62.23,58.42 | LED37.A 69.85,58.42 | LED35.A 54.61,58.42 | LED38.A 77.47,58.42 | LED39.A 85.09,58.42 | LED40.A 92.71,58.42 | LED41.A 100.33,58.42 | LED42.A 107.95,58.42 | LED43.A 115.57,58.42 | LED44.A 123.19,58.42 | LED45.A 130.81,58.42 | LED46.A 138.43,58.42 | LED47.A 146.05,58.42 | IC2.5 13.97,69.85 7.62,63.5 7.62,49.53
N$4  (1 unrouted)
  Top 0.406: LED64.A 153.67,66.04 146.05,66.04 | 62.23,66.04 69.85,66.04 | 54.61,66.04 62.23,66.04 | 54.61,66.04 46.99,66.04 | 77.47,66.04 69.85,66.04 | 85.09,66.04 77.47,66.04 | 92.71,66.04 85.09,66.04 | 100.33,66.04 92.71,66.04 | 107.95,66.04 100.33,66.04 | 115.57,66.04 107.95,66.04 | 123.19,66.04 115.57,66.04 | 130.81,66.04 123.19,66.04 | 138.43,66.04 146.05,66.04 | 138.43,66.04 130.81,66.04 | 46.99,66.04 39.37,66.04 | 39.37,66.04 LED49.A | LED50.A 46.99,66.04 | LED53.A 69.85,66.04 | LED52.A 62.23,66.04 | LED54.A 77.47,66.04 | LED51.A 54.61,66.04 | LED55.A 85.09,66.04 | LED56.A 92.71,66.04 | LED57.A 100.33,66.04 | LED58.A 107.95,66.04 | LED59.A 115.57,66.04 | LED60.A 123.19,66.04 | LED61.A 130.81,66.04 | LED63.A 146.05,66.04 | LED62.A 138.43,66.04 | 39.37,66.04 38.1,66.04 35.56,63.5 35.56,59.69 29.21,53.34 16.51,53.34 | IC2.4 12.7,72.39 5.08,64.77 5.08,53.34
N$5  (1 unrouted)
  Top 0.406: LED65.A 39.37,73.66 46.99,73.66 | LED80.A 153.67,73.66 146.05,73.66 | 54.61,73.66 46.99,73.66 | 62.23,73.66 54.61,73.66 | 69.85,73.66 62.23,73.66 | 77.47,73.66 69.85,73.66 | 85.09,73.66 77.47,73.66 | 92.71,73.66 85.09,73.66 | 100.33,73.66 92.71,73.66 | 107.95,73.66 100.33,73.66 | 115.57,73.66 107.95,73.66 | 123.19,73.66 115.57,73.66 | 130.81,73.66 123.19,73.66 | 138.43,73.66 130.81,73.66 | 146.05,73.66 138.43,73.66 | LED66.A 46.99,73.66 | LED67.A 54.61,73.66 | LED68.A 62.23,73.66 | LED69.A 69.85,73.66 | LED70.A 77.47,73.66 | LED71.A 85.09,73.66 | LED72.A 92.71,73.66 | LED73.A 100.33,73.66 | LED74.A 107.95,73.66 | LED75.A 115.57,73.66 | LED76.A 123.19,73.66 | LED77.A 130.81,73.66 | LED78.A 138.43,73.66 | LED79.A 146.05,73.66 | IC2.3 11.43,74.93 2.54,66.04 2.54,57.15
N$6  (via drill 1)
  Top 0.406: LED81.A 39.37,81.28 | 46.99,81.28 39.37,81.28 | 54.61,81.28 46.99,81.28 | 62.23,81.28 54.61,81.28 | 69.85,81.28 62.23,81.28 | 77.47,81.28 69.85,81.28 | 85.09,81.28 77.47,81.28 | 92.71,81.28 85.09,81.28 | 100.33,81.28 92.71,81.28 | 107.95,81.28 100.33,81.28 | 115.57,81.28 107.95,81.28 | 123.19,81.28 115.57,81.28 | 130.81,81.28 123.19,81.28 | 138.43,81.28 146.05,81.28 | 138.43,81.28 130.81,81.28 | 146.05,81.28 153.67,81.28 LED96.A | LED82.A 46.99,81.28 | LED83.A 54.61,81.28 | LED84.A 62.23,81.28 | LED85.A 69.85,81.28 | LED86.A 77.47,81.28 | LED87.A 85.09,81.28 | LED88.A 92.71,81.28 | LED89.A 100.33,81.28 | LED90.A 107.95,81.28 | LED91.A 115.57,81.28 | LED92.A 123.19,81.28 | LED93.A 130.81,81.28 | LED95.A 146.05,81.28 | LED94.A 138.43,81.28 | IC2.2 12.7,77.47 11.43,78.74 11.43,81.28 v16.51,86.36 | 39.37,81.28 38.1,81.28 36.83,80.01 v34.29,80.01
  Bottom 0.406: v16.51,86.36 27.94,86.36 v34.29,80.01
N$7  (1 unrouted)
  Top 0.406: LED112.A 153.67,88.9 146.05,88.9 | 54.61,88.9 46.99,88.9 | 62.23,88.9 54.61,88.9 | 69.85,88.9 62.23,88.9 | 77.47,88.9 69.85,88.9 | 85.09,88.9 77.47,88.9 | 100.33,88.9 85.09,88.9 | 107.95,88.9 100.33,88.9 | 115.57,88.9 107.95,88.9 | 130.81,88.9 138.43,88.9 | 123.19,88.9 130.81,88.9 | 123.19,88.9 115.57,88.9 | 146.05,88.9 138.43,88.9 | 46.99,88.9 39.37,88.9 | 39.37,88.9 LED97.A | LED98.A 46.99,88.9 | LED99.A 54.61,88.9 | LED100.A 62.23,88.9 | LED101.A 69.85,88.9 | LED102.A 77.47,88.9 | LED103.A 85.09,88.9 | LED105.A 100.33,88.9 | LED106.A 107.95,88.9 | LED107.A 115.57,88.9 | LED110.A 138.43,88.9 | LED109.A 130.81,88.9 | LED108.A 123.19,88.9 | LED111.A 146.05,88.9 | 39.37,88.9 22.86,88.9 16.51,82.55 IC2.1
N$8  (via drill 1)
  Top 0.406: LED113.A 39.37,96.52 | 46.99,96.52 39.37,96.52 | 54.61,96.52 46.99,96.52 | 62.23,96.52 54.61,96.52 | 69.85,96.52 62.23,96.52 | 77.47,96.52 69.85,96.52 | 85.09,96.52 77.47,96.52 | 92.71,96.52 85.09,96.52 | 100.33,96.52 92.71,96.52 | 107.95,96.52 100.33,96.52 | 115.57,96.52 107.95,96.52 | 123.19,96.52 115.57,96.52 | 130.81,96.52 123.19,96.52 | 138.43,96.52 130.81,96.52 | 146.05,96.52 138.43,96.52 | 146.05,96.52 153.67,96.52 LED128.A | LED114.A 46.99,96.52 | LED115.A 54.61,96.52 | LED116.A 62.23,96.52 | LED117.A 69.85,96.52 | LED118.A 77.47,96.52 | LED119.A 85.09,96.52 | LED120.A 92.71,96.52 | LED121.A 100.33,96.52 | LED122.A 107.95,96.52 | LED123.A 115.57,96.52 | LED124.A 123.19,96.52 | LED125.A 130.81,96.52 | LED126.A 138.43,96.52 | LED127.A 146.05,96.52 | IC2.15 27.94,77.47 v35.56,85.09 | 39.37,96.52 38.1,96.52 v35.56,93.98
  Bottom 0.406: v35.56,93.98 v35.56,85.09
N$9
  Top 0.406: LED129.A 39.37,104.14 | 46.99,104.14 39.37,104.14 | 54.61,104.14 46.99,104.14 | 62.23,104.14 54.61,104.14 | 69.85,104.14 62.23,104.14 | 77.47,104.14 69.85,104.14 | 85.09,104.14 77.47,104.14 | 92.71,104.14 85.09,104.14 | 100.33,104.14 92.71,104.14 | 107.95,104.14 100.33,104.14 | 115.57,104.14 107.95,104.14 | 123.19,104.14 115.57,104.14 | 130.81,104.14 123.19,104.14 | 138.43,104.14 130.81,104.14 | 146.05,104.14 138.43,104.14 | 146.05,104.14 153.67,104.14 LED144.A | LED130.A 46.99,104.14 | LED131.A 54.61,104.14 | LED132.A 62.23,104.14 | LED133.A 69.85,104.14 | LED134.A 77.47,104.14 | LED135.A 85.09,104.14 | LED136.A 92.71,104.14 | LED137.A 100.33,104.14 | LED138.A 107.95,104.14 | LED139.A 115.57,104.14 | LED140.A 123.19,104.14 | LED141.A 130.81,104.14 | LED142.A 138.43,104.14 | LED143.A 146.05,104.14 | 39.37,104.14 12.7,104.14 12.7,123.19 IC1.7
N$10  (via drill 1)  (1 unrouted)
  Top 0.406: LED160.A 153.67,111.76 146.05,111.76 | 54.61,111.76 46.99,111.76 | 62.23,111.76 69.85,111.76 | 62.23,111.76 54.61,111.76 | 77.47,111.76 69.85,111.76 | 85.09,111.76 77.47,111.76 | 92.71,111.76 85.09,111.76 | 100.33,111.76 92.71,111.76 | 107.95,111.76 100.33,111.76 | 115.57,111.76 107.95,111.76 | 123.19,111.76 115.57,111.76 | 130.81,111.76 123.19,111.76 | 138.43,111.76 130.81,111.76 | 146.05,111.76 138.43,111.76 | 46.99,111.76 39.37,111.76 | 39.37,111.76 LED145.A | LED146.A 46.99,111.76 | LED147.A 54.61,111.76 | LED149.A 69.85,111.76 | LED148.A 62.23,111.76 | LED150.A 77.47,111.76 | LED151.A 85.09,111.76 | LED152.A 92.71,111.76 | LED153.A 100.33,111.76 | LED154.A 107.95,111.76 | LED155.A 115.57,111.76 | LED156.A 123.19,111.76 | LED157.A 130.81,111.76 | LED158.A 138.43,111.76 | LED159.A 146.05,111.76 | 39.37,111.76 36.83,111.76 33.02,107.95 v15.24,107.95 | IC1.6 11.43,125.73 8.89,123.19 8.89,107.95
  Bottom 0.406: v15.24,107.95 8.89,107.95
N$11  (via drill 1)  (1 unrouted)
  Top 0.406: LED161.A 39.37,119.38 | 46.99,119.38 39.37,119.38 | 54.61,119.38 46.99,119.38 | 62.23,119.38 69.85,119.38 | 62.23,119.38 54.61,119.38 | 77.47,119.38 69.85,119.38 | 85.09,119.38 77.47,119.38 | 92.71,119.38 85.09,119.38 | 100.33,119.38 92.71,119.38 | 107.95,119.38 100.33,119.38 | 115.57,119.38 107.95,119.38 | 123.19,119.38 115.57,119.38 | 130.81,119.38 123.19,119.38 | 138.43,119.38 130.81,119.38 | 146.05,119.38 138.43,119.38 | 146.05,119.38 153.67,119.38 LED176.A | LED162.A 46.99,119.38 | LED163.A 54.61,119.38 | LED165.A 69.85,119.38 | LED164.A 62.23,119.38 | LED166.A 77.47,119.38 | LED167.A 85.09,119.38 | LED168.A 92.71,119.38 | LED169.A 100.33,119.38 | LED170.A 107.95,119.38 | LED171.A 115.57,119.38 | LED172.A 123.19,119.38 | LED173.A 130.81,119.38 | LED174.A 138.43,119.38 | LED175.A 146.05,119.38 | 39.37,119.38 31.75,111.76 15.24,111.76 | IC1.5 10.16,128.27 6.35,124.46 v6.35,111.76
  Bottom 0.406: v6.35,111.76 15.24,111.76
N$12  (via drill 1)  (1 unrouted)
  Top 0.406: LED192.A 153.67,127 146.05,127 | 54.61,127 46.99,127 | 62.23,127 69.85,127 | 62.23,127 54.61,127 | 77.47,127 69.85,127 | 85.09,127 77.47,127 | 92.71,127 85.09,127 | 100.33,127 92.71,127 | 107.95,127 100.33,127 | 115.57,127 107.95,127 | 123.19,127 115.57,127 | 130.81,127 123.19,127 | 138.43,127 130.81,127 | 146.05,127 138.43,127 | 46.99,127 39.37,127 | 39.37,127 LED177.A | LED178.A 46.99,127 | LED179.A 54.61,127 | LED181.A 69.85,127 | LED180.A 62.23,127 | LED182.A 77.47,127 | LED183.A 85.09,127 | LED184.A 92.71,127 | LED185.A 100.33,127 | LED186.A 107.95,127 | LED187.A 115.57,127 | LED188.A 123.19,127 | LED189.A 130.81,127 | LED190.A 138.43,127 | LED191.A 146.05,127 | 39.37,127 31.75,119.38 31.75,115.57 15.24,115.57 | IC1.4 8.89,130.81 3.81,125.73 v3.81,115.57
  Bottom 0.406: v3.81,115.57 15.24,115.57
N$13  (via drill 1)  (1 unrouted)
  Top 0.406: LED193.A 39.37,134.62 | LED208.A 153.67,134.62 146.05,134.62 | 54.61,134.62 46.99,134.62 | 62.23,134.62 69.85,134.62 | 62.23,134.62 54.61,134.62 | 77.47,134.62 69.85,134.62 | 85.09,134.62 77.47,134.62 | 92.71,134.62 85.09,134.62 | 100.33,134.62 92.71,134.62 | 107.95,134.62 100.33,134.62 | 115.57,134.62 107.95,134.62 | 123.19,134.62 115.57,134.62 | 130.81,134.62 123.19,134.62 | 138.43,134.62 130.81,134.62 | 146.05,134.62 138.43,134.62 | 46.99,134.62 39.37,134.62 | LED194.A 46.99,134.62 | LED195.A 54.61,134.62 | LED197.A 69.85,134.62 | LED196.A 62.23,134.62 | LED198.A 77.47,134.62 | LED199.A 85.09,134.62 | LED200.A 92.71,134.62 | LED201.A 100.33,134.62 | LED202.A 107.95,134.62 | LED203.A 115.57,134.62 | LED204.A 123.19,134.62 | LED205.A 130.81,134.62 | LED206.A 138.43,134.62 | LED207.A 146.05,134.62 | 39.37,134.62 38.1,134.62 33.02,139.7 33.02,144.78 v19.05,144.78 | IC1.3 11.43,133.35 11.43,144.78
  Bottom 0.406: v19.05,144.78 11.43,144.78
N$14  (via drill 1)  (1 unrouted)
  Top 0.406: LED209.A 39.37,142.24 | 46.99,142.24 39.37,142.24 | 138.43,142.24 146.05,142.24 | 85.09,142.24 77.47,142.24 | 92.71,142.24 85.09,142.24 | 100.33,142.24 92.71,142.24 | 107.95,142.24 100.33,142.24 | 115.57,142.24 107.95,142.24 | 123.19,142.24 115.57,142.24 | 130.81,142.24 123.19,142.24 | 130.81,142.24 138.43,142.24 | 62.23,142.24 54.61,142.24 | 69.85,142.24 62.23,142.24 | 69.85,142.24 77.47,142.24 | 54.61,142.24 46.99,142.24 | 146.05,142.24 153.67,142.24 LED224.A | LED210.A 46.99,142.24 | LED223.A 146.05,142.24 | LED222.A 138.43,142.24 | LED214.A 77.47,142.24 | LED215.A 85.09,142.24 | LED216.A 92.71,142.24 | LED217.A 100.33,142.24 | LED218.A 107.95,142.24 | LED219.A 115.57,142.24 | LED220.A 123.19,142.24 | LED221.A 130.81,142.24 | LED211.A 54.61,142.24 | LED212.A 62.23,142.24 | LED213.A 69.85,142.24 | 39.37,142.24 34.29,147.32 v21.59,147.32 | IC1.2 13.97,135.89 13.97,147.32
  Bottom 0.406: v21.59,147.32 13.97,147.32
N$15
  Top 0.406: LED240.A 153.67,149.86 146.05,149.86 | 138.43,149.86 146.05,149.86 | 85.09,149.86 77.47,149.86 | 92.71,149.86 85.09,149.86 | 100.33,149.86 92.71,149.86 | 107.95,149.86 100.33,149.86 | 115.57,149.86 107.95,149.86 | 123.19,149.86 130.81,149.86 | 123.19,149.86 115.57,149.86 | 130.81,149.86 138.43,149.86 | 62.23,149.86 69.85,149.86 | 62.23,149.86 54.61,149.86 | 69.85,149.86 77.47,149.86 | 54.61,149.86 46.99,149.86 | 46.99,149.86 39.37,149.86 | 39.37,149.86 LED225.A | LED226.A 46.99,149.86 | LED239.A 146.05,149.86 | LED238.A 138.43,149.86 | LED230.A 77.47,149.86 | LED231.A 85.09,149.86 | LED232.A 92.71,149.86 | LED233.A 100.33,149.86 | LED234.A 107.95,149.86 | LED235.A 115.57,149.86 | LED237.A 130.81,149.86 | LED236.A 123.19,149.86 | LED227.A 54.61,149.86 | LED229.A 69.85,149.86 | LED228.A 62.23,149.86 | 39.37,149.86 20.32,149.86 16.51,146.05 IC1.1
N$16  (1 unrouted)
  Top 0.406: LED241.A 39.37,157.48 | LED256.A 153.67,157.48 146.05,157.48 | 138.43,157.48 146.05,157.48 | 85.09,157.48 77.47,157.48 | 92.71,157.48 85.09,157.48 | 100.33,157.48 92.71,157.48 | 107.95,157.48 100.33,157.48 | 115.57,157.48 107.95,157.48 | 123.19,157.48 115.57,157.48 | 130.81,157.48 123.19,157.48 | 130.81,157.48 138.43,157.48 | 62.23,157.48 54.61,157.48 | 69.85,157.48 62.23,157.48 | 69.85,157.48 77.47,157.48 | 54.61,157.48 46.99,157.48 | 46.99,157.48 39.37,157.48 | 46.99,157.48 LED242.A | LED255.A 146.05,157.48 | LED254.A 138.43,157.48 | LED246.A 77.47,157.48 | LED247.A 85.09,157.48 | LED248.A 92.71,157.48 | LED249.A 100.33,157.48 | LED250.A 107.95,157.48 | LED251.A 115.57,157.48 | LED252.A 123.19,157.48 | LED253.A 130.81,157.48 | LED243.A 54.61,157.48 | LED244.A 62.23,157.48 | LED245.A 69.85,157.48 | 39.37,157.48 35.56,157.48 30.48,152.4
N$17  (13 unrouted)
  Bottom 0.406: IC4.3 LED13.K LED125.K LED253.K
N$18  (13 unrouted)
  Bottom 0.406: IC4.2 135.89,33.02 140.97,38.1 LED14.K LED126.K LED254.K
N$19  (13 unrouted)
  Bottom 0.406: IC4.1 138.43,30.48 140.97,33.02 144.78,33.02 148.59,36.83 LED15.K LED127.K LED255.K
N$20  (12 unrouted)
  Bottom 0.406: IC3.7 69.85,26.67 68.58,27.94 53.34,27.94 LED1.K LED17.K LED113.K LED241.K
N$21  (14 unrouted)
  Bottom 0.406: IC3.6 72.39,26.67 68.58,30.48 58.42,30.48 LED2.K LED114.K 49.53,152.4
N$22  (13 unrouted)
  Bottom 0.406: IC3.5 74.93,27.94 72.39,30.48 71.12,30.48 68.58,33.02 63.5,33.02 LED3.K LED115.K LED243.K
N$23  (13 unrouted)
  Bottom 0.406: IC3.4 77.47,30.48 74.93,33.02 71.12,33.02 LED4.K LED116.K LED244.K
N$24  (13 unrouted)
  Bottom 0.406: IC3.3 80.01,31.75 LED5.K LED117.K LED245.K
N$25  (13 unrouted)
  Bottom 0.406: IC3.2 82.55,33.02 LED6.K LED118.K LED246.K
N$26  (13 unrouted)
  Bottom 0.406: IC3.1 85.09,33.02 87.63,36.83 LED7.K LED119.K LED247.K
N$27  (13 unrouted)
  Bottom 0.406: IC3.15 82.55,11.43 91.44,11.43 91.44,33.02 LED8.K 95.25,91.44 LED120.K LED248.K
N$28  (13 unrouted)
  Bottom 0.406: IC4.7 123.19,26.67 120.65,29.21 109.22,29.21 102.87,35.56 LED9.K LED121.K LED249.K
N$29  (13 unrouted)
  Bottom 0.406: IC4.6 125.73,27.94 121.92,31.75 116.84,31.75 110.49,38.1 LED10.K LED122.K LED250.K
N$30  (13 unrouted)
  Bottom 0.406: IC4.5 128.27,29.21 LED11.K LED123.K LED251.K
N$31  (13 unrouted)
  Bottom 0.406: IC4.4 130.81,31.75 125.73,36.83 LED12.K LED124.K LED252.K
N$32  (13 unrouted)
  Bottom 0.406: IC4.15 135.89,11.43 143.51,11.43 143.51,25.4 156.21,38.1 LED16.K LED128.K LED256.K
N$34  (via drill 1)
  other vias: 16.51,45.72
N$35  (via drill 1)
  Bottom 0.406: v10.16,45.72 16.51,45.72
N$36  (via drill 1)
  Top 0.406: v16.51,49.53 33.02,49.53 34.29,50.8 34.29,55.88 36.83,58.42 39.37,58.42
  Bottom 0.406: v16.51,49.53 7.62,49.53
N$37  (via drill 1)
  other vias: 16.51,53.34
N$38  (via drill 1)
  Top 0.406: v16.51,57.15 27.94,57.15 33.02,62.23 33.02,68.58 38.1,73.66 39.37,73.66
  Bottom 0.406: v16.51,57.15 2.54,57.15
N$39  (via drill 1)
  other vias: 7.62,49.53
N$40  (via drill 1)
  Bottom 0.406: v5.08,53.34 16.51,53.34
N$41  (via drill 1)
  other vias: 2.54,57.15
N$45  (via drill 1)
  other vias: 15.24,111.76
N$46  (via drill 1)
  other vias: 15.24,115.57
N$47  (via drill 1)
  Bottom 0.406: v30.48,152.4 30.48,137.16 29.21,135.89 24.13,135.89
N$48  (via drill 1)
  other vias: 13.97,147.32
N$49  (via drill 1)
  other vias: 11.43,144.78
N$51  (via drill 1)
  Top 0.406: J1.8 15.59,18.7 24.13,10.16 v72.39,10.16
  Bottom 0.406: IC3.11 v72.39,10.16 72.39,5.08 v74.93,2.54 123.19,2.54 125.73,5.08 IC4.11
N$52  (via drill 1)
  other vias: 8.89,107.95
N$53  (via drill 1)
  Top 0.406: v119.38,12.7 127,12.7 128.27,13.97 IC4.12 | J1.9 12.59,17.89 25.4,5.08 v76.2,5.08
  Bottom 0.406: IC3.12 74.93,6.35 v76.2,5.08 118.11,5.08 119.38,6.35 v119.38,12.7
N$54
  Top 0.406: IC4.14 133.35,7.62 68.58,7.62 67.31,8.89 IC3.9
N$55  (via drill 1)
  other vias: 137.16,8.89
N$56  (1 unrouted)
N$57  (via drill 1)
  other vias: 13.97,12.7
N$58  (1 unrouted)
N$59  (via drill 1)
  Top 0.406: v30.48,125.73 IC1.11
  Bottom 0.406: IC2.11 27.94,67.31 30.48,69.85 | 30.48,69.85 30.48,81.28 27.94,83.82 12.7,83.82 11.43,85.09 11.43,97.79 12.7,99.06 29.21,99.06 30.48,100.33 v30.48,125.73 | 30.48,69.85 30.48,24.75 J1.3
N$60  (via drill 1)
  Top 0.406: v27.94,71.12 v27.94,64.77
  Bottom 0.406: IC2.12 26.67,69.85 v27.94,71.12 27.94,80.01 25.4,82.55 8.89,82.55 7.62,83.82 7.62,100.33 8.89,101.6 26.67,101.6 27.94,102.87 27.94,127 26.67,128.27 IC1.12 | v27.94,64.77 27.94,24.99 J1.4
N$61  (1 unrouted)
N$62
  Bottom 0.406: IC2.14 21.59,74.93 20.32,73.66 20.32,36.83 24.59,32.56 J1.5
N$64  (via drill 1)  (1 unrouted)
  Top 0.406: J1.10 9.59,17.08 13.97,12.7 | IC3.14 80.01,13.97 78.74,12.7 v69.85,12.7
  Bottom 0.406: v69.85,12.7 13.97,12.7
VCC  (via drill 1)  (1 unrouted)
  Top 0.406: v129.54,10.16 85.09,10.16 IC3.16 85.09,20.32 86.36,20.32 | 137.16,8.89 138.43,10.16 IC4.16 138.43,19.05 137.16,20.32 123.19,20.32 | IC4.10 123.19,20.32 | 123.19,20.32 86.36,20.32 | 86.36,20.32 69.85,20.32 | 69.85,20.32 IC3.10 | IC2.16 20.32,80.01 | 20.32,80.01 19.05,78.74 19.05,64.77 | 19.05,64.77 IC2.10 | 20.32,80.01 25.4,85.09 30.48,85.09 v31.75,86.36 | v20.32,96.52 15.24,96.52 8.89,102.87 v8.89,104.14 | 69.85,20.32 38.1,20.32 36.83,21.59 36.83,27.94 35.56,29.21 33.02,29.21 v24.13,38.1 | v24.13,59.69 19.05,59.69 19.05,64.77
  Bottom 0.406: v129.54,10.16 130.81,10.16 132.08,8.89 137.16,8.89 | v31.75,86.36 31.75,92.71 21.59,92.71 20.32,93.98 v20.32,96.52 | v8.89,104.14 10.16,105.41 19.05,105.41 20.32,106.68 20.32,123.19 | 20.32,123.19 IC1.10 | 20.32,123.19 20.32,137.16 21.59,138.43 IC1.16 | v24.13,38.1 v24.13,59.69